# EAGLE design base-board (EAGLE 7.4.0)
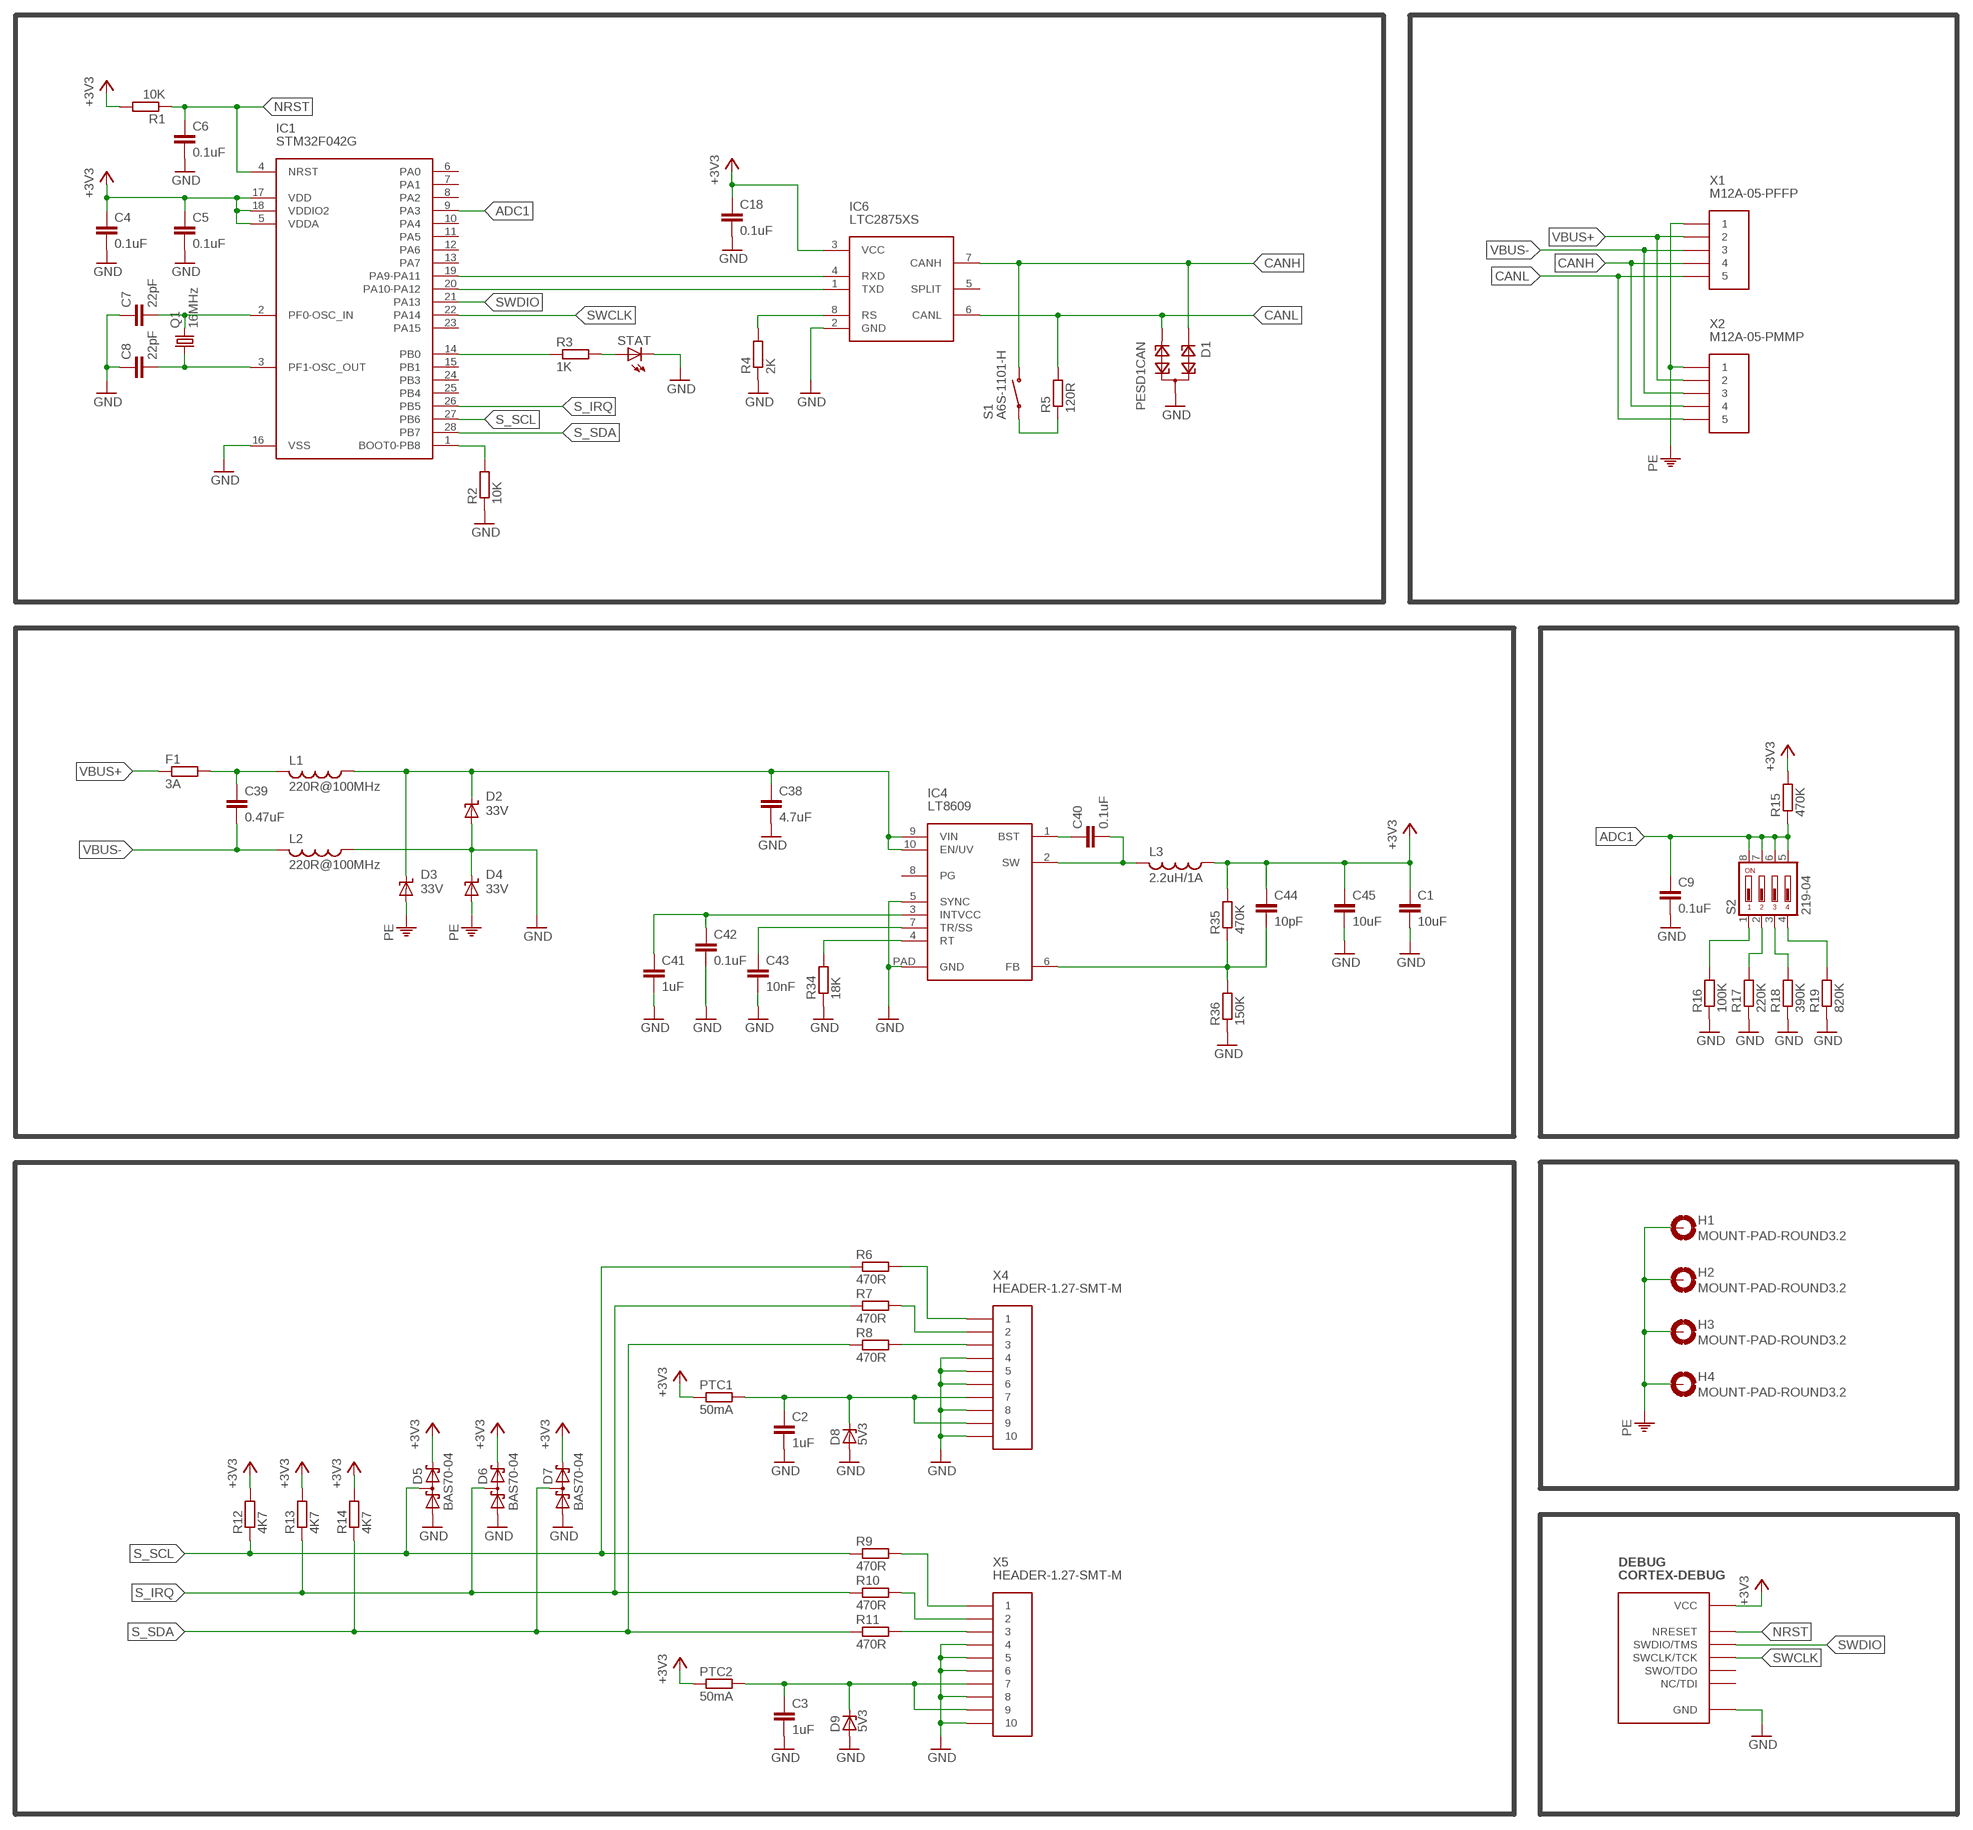
[diagram p0: schematic, sheet 1]

## Parts
C1  10uF  C-EUC1206  [C1206]
C2  1uF  C-EUC0603  [C0603]
C3  1uF  C-EUC0603  [C0603]
C4  0.1uF  C-EUC0603  [C0603]
C5  0.1uF  C-EUC0603  [C0603]
C6  0.1uF  C-EUC0603  [C0603]
C7  22pF  C-EUC0603  [C0603]
C8  22pF  C-EUC0603  [C0603]
C9  0.1uF  C-EUC0603  [C0603]
C18  0.1uF  C-EUC0603  [C0603]
C38  4.7uF  C-EUC1206  [C1206]
C39  0.47uF  C-EUC1206  [C1206]
C40  0.1uF  C-EUC0603  [C0603]
C41  1uF  C-EUC0603  [C0603]
C42  0.1uF  C-EUC0603  [C0603]
C43  10nF  C-EUC0603  [C0603]
C44  10pF  C-EUC0603  [C0603]
C45  10uF  C-EUC1206  [C1206]
D1  PESD1CAN  [SOT23]
D2  33V  SUPPRESSOR-SMBJ  [SMBJ]
D3  33V  SUPPRESSOR-SMBJ  [SMBJ]
D4  33V  SUPPRESSOR-SMBJ  [SMBJ]
D5  BAS70-04  [SOT23]
D6  BAS70-04  [SOT23]
D7  BAS70-04  [SOT23]
D8  5V3  ZENER-DIODESOT23  [SOT23]
D9  5V3  ZENER-DIODESOT23  [SOT23]
DEBUG  CORTEX-DEBUG  [CORTEX-DEBUG]
F1  3A  R-EU_R0805  [R0805]
H1  MOUNT-PAD-ROUND3.2  [3,2-PAD]
H2  MOUNT-PAD-ROUND3.2  [3,2-PAD]
H3  MOUNT-PAD-ROUND3.2  [3,2-PAD]
H4  MOUNT-PAD-ROUND3.2  [3,2-PAD]
IC1  STM32F042G  [UFQFPN28]
IC4  LT8609  [MSOP10-PAD]
IC6  LTC2875XS  [SOIC8]
L1  220R@100MHz  L-USL3216C  [L3216C]
L2  220R@100MHz  L-USL3216C  [L3216C]
L3  2.2uH/1A  L-USL3216C  [L3216C]
PTC1  50mA  R-EU_R1206  [R1206]
PTC2  50mA  R-EU_R1206  [R1206]
Q1  16MHz  XO_3225  [XTAL_3225]
R1  10K  R-EU_R0603  [R0603]
R2  10K  R-EU_R0603  [R0603]
R3  1K  R-EU_R0603  [R0603]
R4  2K  R-EU_R0603  [R0603]
R5  120R  R-EU_R0603  [R0603]
R6  470R  R-EU_R0603  [R0603]
R7  470R  R-EU_R0603  [R0603]
R8  470R  R-EU_R0603  [R0603]
R9  470R  R-EU_R0603  [R0603]
R10  470R  R-EU_R0603  [R0603]
R11  470R  R-EU_R0603  [R0603]
R12  4K7  R-EU_R0603  [R0603]
R13  4K7  R-EU_R0603  [R0603]
R14  4K7  R-EU_R0603  [R0603]
R15  470K  R-EU_R0603  [R0603]
R16  100K  R-EU_R0603  [R0603]
R17  220K  R-EU_R0603  [R0603]
R18  390K  R-EU_R0603  [R0603]
R19  820K  R-EU_R0603  [R0603]
R34  18K  R-EU_R0603  [R0603]
R35  470K  R-EU_R0603  [R0603]
R36  150K  R-EU_R0603  [R0603]
S1  A6S-1101-H  [A6S-1]
S2  219-04  [CTS-219-04]
STAT  LEDCHIPLED_0805  [CHIPLED_0805]
X1  M12A-05-PFFP  [AMP-M12A-05-PFFP]
X2  M12A-05-PMMP  [AMP-M12A-05-PMMP]
X4  HEADER-1.27-SMT-M  [HEADER-1.27-SMT-M]
X5  HEADER-1.27-SMT-M  [HEADER-1.27-SMT-M]

## Nets
+3V3: C1.1 C4.1 C5.1 C18.1 C44.1 C45.1 D5.2(C2) D6.2(C2) D7.2(C2) DEBUG.VCC IC1.5(VDDA) IC1.17(VDD) IC1.18(VDDIO2) IC6.3(VCC) L3.1 PTC1.1 PTC2.1 R1.2 R12.2 R13.2 R14.2 R15.2 R35.2
ADC1: C9.1 IC1.9(PA3) R15.1 S2.5 S2.6 S2.7 S2.8
CANH [can]: D1.1 IC6.7(CANH) S1.1B(B) X1.4 X2.4
CANL [can]: D1.2 IC6.6(CANL) R5.2 X1.5 X2.5
GND: C1.2 C2.2 C3.2 C4.2 C5.2 C6.2 C7.1 C8.1 C9.2 C18.2 C38.2 C41.2 C42.2 C43.2 C45.2 D1.3 D2.A D4.C D5.1(A1) D6.1(A1) D7.1(A1) D8.1(A) D9.1(A) DEBUG.GND1(GND) DEBUG.GND2(GND) DEBUG.GND_DETECT(GND) IC1.16(VSS) IC4.5(SYNC) IC4.PAD(GND) IC6.2(GND) L2.1 R2.1 R4.1 R16.1 R17.1 R18.1 R19.1 R34.1 R36.1 STAT.C X4.4 X4.5 X4.6 X4.8 X4.10 X5.4 X5.5 X5.6 X5.8 X5.10
LED: IC1.14(PB0) R3.1
N$1 [power]: C38.1 D2.C D3.C IC4.9(VIN) IC4.10(EN/UV) L1.1
N$2: R3.2 STAT.A
N$3: IC1.20(PA10-PA12) IC6.1(TXD)
N$4: IC1.19(PA9-PA11) IC6.4(RXD)
N$5: IC6.8(RS) R4.2
N$6: R5.1 S1.1A(A)
N$7: R8.2 X4.3
N$8: C39.1 F1.2 L1.2
N$9: C7.2 IC1.2(PF0-OSC_IN) Q1.3
N$10: C8.2 IC1.3(PF1-OSC_OUT) Q1.1
N$11: IC1.1(BOOT0-PB8) R2.2
N$12: R7.2 X4.2
N$13: C2.1 D8.3(C) PTC1.2 X4.7 X4.9
N$14: C3.1 D9.3(C) PTC2.2 X5.7 X5.9
N$15: R6.2 X4.1
N$16: R11.2 X5.3
N$17: R10.2 X5.2
N$18: R9.2 X5.1
N$20: R16.2 S2.1
N$21: R17.2 S2.2
N$22: R18.2 S2.3
N$23: R19.2 S2.4
N$39: C40.1 IC4.1(BST)
N$40: C40.2 IC4.2(SW) L3.2
N$42: C41.1 C42.1 IC4.3(INTVCC)
N$44: C43.1 IC4.7(TR/SS)
N$45: IC4.4(RT) R34.2
N$46: C44.2 IC4.6(FB) R35.1 R36.2
NRST: C6.1 DEBUG.NRESET IC1.4(NRST) R1.1
PE [pe]: D3.A D4.A H1.B3,2(MOUNT) H2.B3,2(MOUNT) H3.B3,2(MOUNT) H4.B3,2(MOUNT) X1.1 X2.1
S_IRQ: D6.3(C1A2) IC1.26(PB5) R7.1 R10.1 R13.1
S_SCL: D5.3(C1A2) IC1.27(PB6) R6.1 R9.1 R12.1
S_SDA: D7.3(C1A2) IC1.28(PB7) R8.1 R11.1 R14.1
SWCLK: DEBUG.SWCLK/TCK IC1.22(PA14)
SWDIO: DEBUG.SWDIO/TMS IC1.21(PA13)
VBUS+ [power]: F1.1 X1.2 X2.2
VBUS- [power]: C39.2 L2.2 X1.3 X2.3
Unconnected: DEBUG.NC/TDI DEBUG.SWO/TDO IC1.6(PA0) IC1.7(PA1) IC1.8(PA2) IC1.10(PA4) IC1.11(PA5) IC1.12(PA6) IC1.13(PA7) IC1.15(PB1) IC1.23(PA15) IC1.24(PB3) IC1.25(PB4) IC4.8(PG) IC6.5(SPLIT)

## Library data of the parts
C1-C9 C18 C38-C45 = rcl:C-EU: CAPACITOR, European symbol
D1 = diode:PESD1CAN: CAN bus ESD protection diode Source: http://www.nxp.com/documents/data_sheet/PESD1CAN.pdf
D2-D4 = diode:SUPPRESSOR-: Suppressor diode
D5-D7 = diode:BAS70-04: Silicon Schottky Diodes General-purpose diode for high-speed switching
D8 D9 = diode:ZENER-DIODE: Z-Diode
DEBUG = debug-connectors:CORTEX-DEBUG
F1 PTC1 PTC2 R1-R19 R34-R36 = rcl:R-EU_: RESISTOR, European symbol
H1-H4 = holes:MOUNT-PAD-ROUND: MOUNTING PAD, round
IC1 = stm32f042xx:STM32F042G
IC4 = dc-dc-regulators:LT8609
IC6 = can-transceivers:LTC2875
L1-L3 = rcl:L-US: INDUCTOR, American symbol
Q1 = crystals:XO_3225
S1 = omron-a6s:A6S-1101-H
S2 = switch-dil:219-04*: Surface Mount DIP Switch Series 219 SMT CTS Electronic Components Sourc: www.ctscorp.com; OC_FARNELL: unknown; OC_NEWARK: unknown
STAT = led:LED: LED OSRAM: - CHIPLED LG R971, LG N971, LY N971, LG Q971, LY Q971, LO R971, LY R971 LH N974, LH R974 LS Q976, LO Q976, LY Q976 LO Q996 - Hyper CHIPLED LW Q18S LB Q993, LB Q99A, LB R99A - SideLED LS A670, LO A670, LY A670, LG A670, LP A670 LB A673, LV A673, LT A673, LW A673 LH A674 LY A675 LS A676, LA A676, LO A676, LY A676, LW A676 LS A679, LY A679, LG A679 - Hyper Micro SIDELED® LS Y876, LA Y876, LO Y876, LY Y876 LT Y87S - SmartLED LW L88C, LW L88S LB L89C, LB L89S, LG L890 LS L89K, LO L89K, LY L89K LS L896, LA L896, LO L896, LY L896 - TOPLED LS T670, LO T670, LY T670, LG T670, LP T670 LSG T670, LSP T670, LSY T670, LOP T670, LYG T670 LG T671, LOG T671, LSG T671 LB T673, LV T673, LT T673, LW T673 LH T674 LS T676, LA T676, LO T676, LY T676, LB T676, LH T676, LSB T676, LW T676 LB T67C, LV T67C, LT T67C, LS T67K, LO T67K, LY T67K, LW E67C LS E67B, LA E67B, LO E67B, LY E67B, LB E67C, LV E67C, LT E67C LW T67C LS T679, LY T679, LG T679 LS T770, LO T770, LY T770, LG T770, LP T770 LB T773, LV T773, LT T773, LW T773 LH T774 LS E675, LA E675, LY E675, LS T675 LS T776, LA T776, LO T776, LY T776, LB T776 LHGB T686 LT T68C, LB T68C - Hyper Mini TOPLED® LB M676 - Mini TOPLED Santana® LG M470 LS M47K, LO M47K, LY M47K Source: http://www.osram.convergy.de LUXEON: - LUMILED® LXK2-PW12-R00, LXK2-PW12-S00, LXK2-PW14-U00, LXK2-PW14-V00 LXK2-PM12-R00, LXK2-PM12-S00, LXK2-PM14-U00 LXK2-PE12-Q00, LXK2-PE12-R00, LXK2-PE12-S00, LXK2-PE14-T00, LXK2-PE14-U00 LXK2-PB12-K00, LXK2-PB12-L00, LXK2-PB12-M00, LXK2-PB14-N00, LXK2-PB14-P00, LXK2-PB14-Q00 LXK2-PR12-L00, LXK2-PR12-M00, LXK2-PR14-Q00, LXK2-PR14-R00 LXK2-PD12-Q00, LXK2-PD12-R00, LXK2-PD12-S00 LXK2-PH12-R00, LXK2-PH12-S00 LXK2-PL12-P00, LXK2-PL12-Q00, LXK2-PL12-R00 Source: www.luxeon.com KINGBRIGHT: KA-3528ASYC Source: www.kingbright.com
X1 = con-amphenol-m12:M12A-05-PFFP
X2 = con-amphenol-m12:M12A-05-PMMP
X4 X5 = con-headers:HEADER-1.27-SMT-M

## Net classes
0 default: width 0.2 mm, drill 0.3 mm, clearance 0.15 mm
1 can: width 0.4 mm, drill 0.3 mm, clearance 0.4 mm
2 pe: width 0.8 mm, drill 0.6 mm, clearance 0.6 mm
3 power: width 0.8 mm, drill 0.6 mm, clearance 0.6 mm

## Board
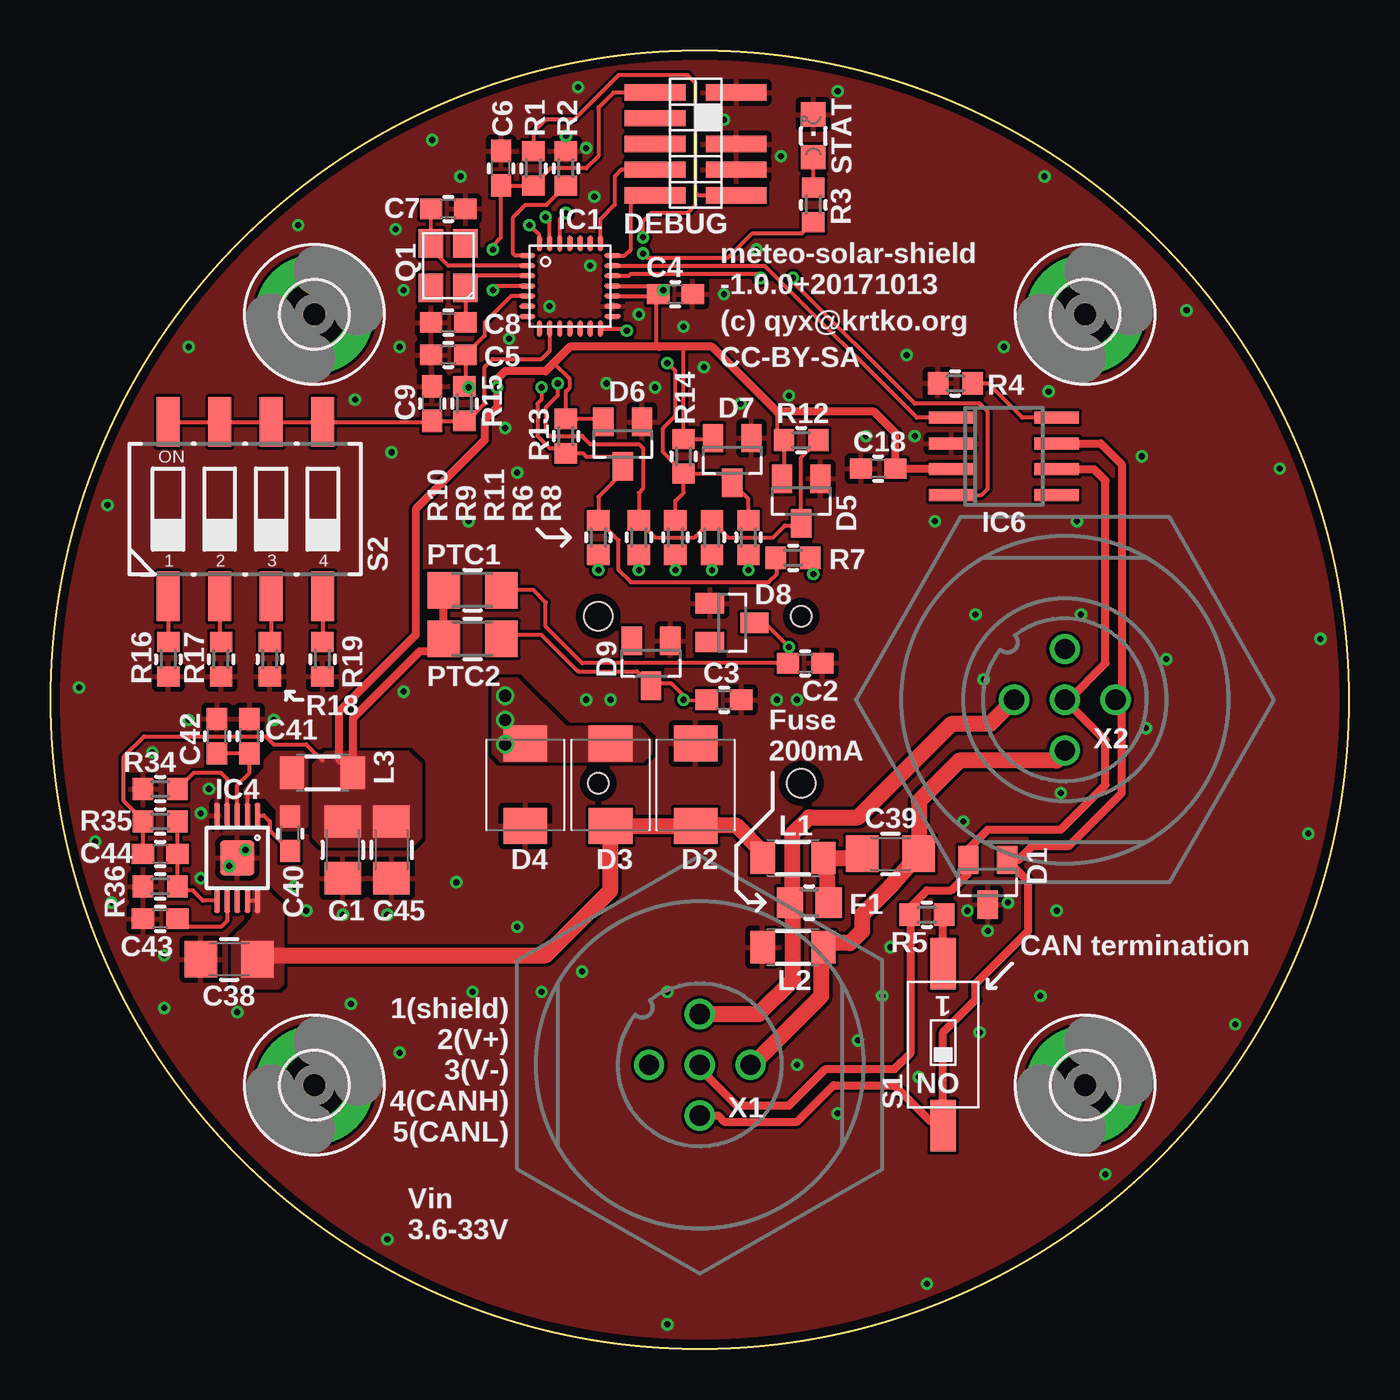
[diagram p1: board, top side]
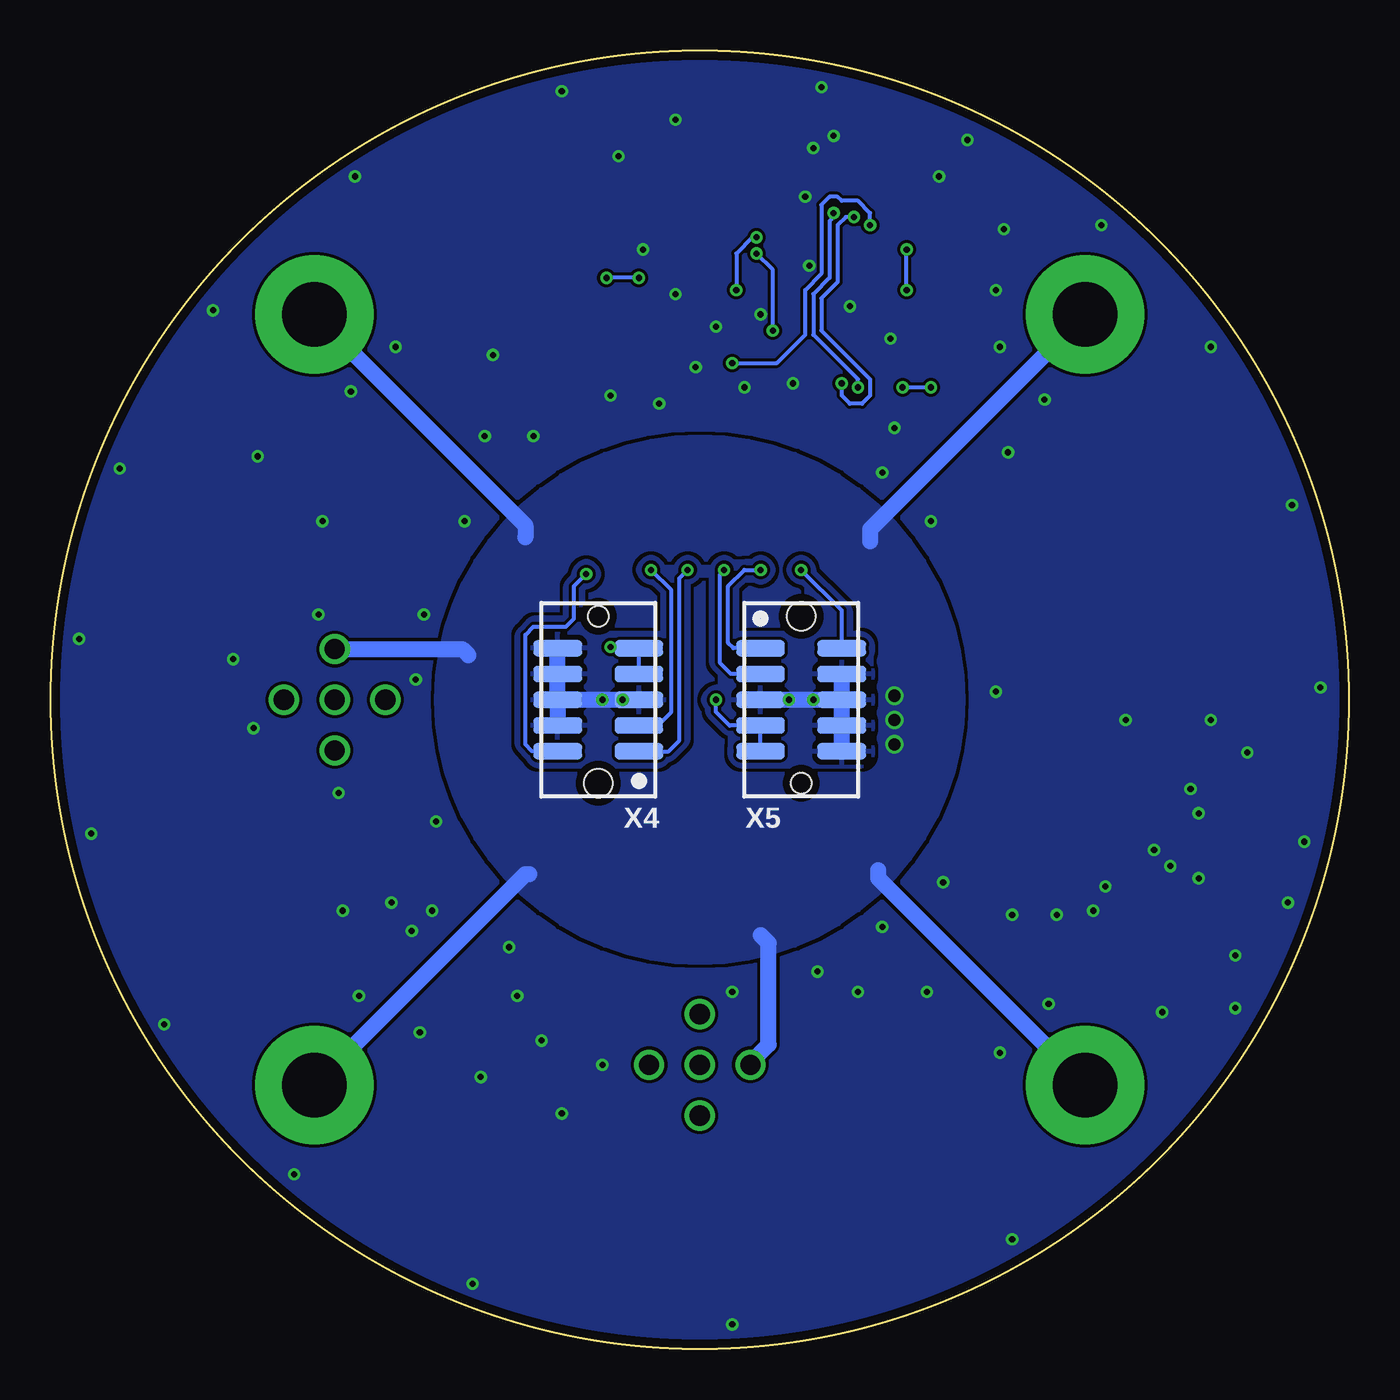
[diagram p2: board, bottom side, seen from below]

Size 64 x 64 mm. Coordinates in mm from the lower left corner, seen from the top.
Outline: circle at 32,32 radius 32
Copper layers (1*16): Top 0.035mm / dielectric 1.5mm / Bottom 0.035mm
Design rules "seeed": minimum track width 0.2mm, minimum drill 0.3mm, track to track 0.15mm, track to pad 0.15mm, pad to pad 0.15mm, via to via 0.15mm, smd to smd 0mil, copper to edge 0.4mm, drill to drill 0.4mm, minimum pad ring 6mil, minimum via ring 6mil, stop-mask expansion 2mil, vias tented up to drill 0.5mm, thermal gap 10mil

### Footprints (pad centres in the part's own frame; a part is rotated, then mirrored left to right if it is on the bottom)
C1206 = smd 1.6 x 1.8: 1 -1.4,0; 2 1.4,0
C0603 = smd 1.1 x 1: 1 -0.85,0; 2 0.85,0
SOT23 = smd 1 x 1.4: 1 -0.95,-1.1; 2 0.95,-1.1; 3 0,1.1
SMBJ = smd 1.78 x 2.16: A 2.04,0; C -2.03,0
CORTEX-DEBUG = smd 0.8 x 3: GND1 -1.27,-2; GND2 0,-2; GND_DETECT 2.54,-2; NC/TDI 1.27,2; NRESET 2.54,2; SWCLK/TCK -1.27,2; SWDIO/TMS -2.54,2; SWO/TDO 0,2; VCC -2.54,-2
R0805 = smd 1.3 x 1.5: 1 -0.95,0; 2 0.95,0
3,2-PAD = drill 3.2 pad 5.842: B3,2 0,0
UFQFPN28 = smd 0.8 x 0.25: 1 -2.1,1.5; 2 -2.1,1; 3 -2.1,0.5; 4 -2.1,0; 5 -2.1,-0.5; 6 -2.1,-1; 7 -2.1,-1.5; 15 2.1,-1.5; 16 2.1,-1; 17 2.1,-0.5; 18 2.1,0; 19 2.1,0.5; 20 2.1,1; 21 2.1,1.5 | smd 0.25 x 0.8: 8 -1.5,-2.1; 9 -1,-2.1; 10 -0.5,-2.1; 11 0,-2.1; 12 0.5,-2.1; 13 1,-2.1; 14 1.5,-2.1; 22 1.5,2.1; 23 1,2.1; 24 0.5,2.1; 25 0,2.1; 26 -0.5,2.1; 27 -1,2.1; 28 -1.5,2.1
MSOP10-PAD = smd 0.3 x 1.2: 1 -1,-2.1; 2 -0.5,-2.1; 3 0,-2.1; 4 0.5,-2.1; 5 1,-2.1; 6 1,2.1; 7 0.5,2.1; 8 0,2.1; 9 -0.5,2.1; 10 -1,2.1 | smd 1.7 x 1.7: PAD 0,0
SOIC8 = smd 0.6 x 2.2: 1 -1.905,-2.6; 2 -0.635,-2.6; 3 0.635,-2.6; 4 1.905,-2.6; 5 1.905,2.6; 6 0.635,2.6; 7 -0.635,2.6; 8 -1.905,2.6
L3216C = smd 1.2 x 1.6: 1 -1.5,0; 2 1.5,0
R1206 = smd 1.6 x 1.803: 1 -1.422,0; 2 1.422,0
XTAL_3225 = smd 1.4 x 1.2: 1 -1.1,-0.85; 2 1.1,-0.85; 3 1.1,0.85; 4 -1.1,0.85
R0603 = smd 1 x 1.1: 1 -0.85,0; 2 0.85,0
A6S-1 = smd 1.27 x 2.54: 1A 0,-4; 1B 0,4
CTS-219-04 = smd 1.13 x 2.44: 1 -3.81,-4.3; 2 -1.27,-4.3; 3 1.27,-4.3; 4 3.81,-4.3; 5 3.81,4.3; 6 1.27,4.3; 7 -1.27,4.3; 8 -3.81,4.3
CHIPLED_0805 = smd 1.2 x 1.2: A 0,-1.05; C 0,1.05
AMP-M12A-05-PFFP = drill 1: 1 -2.5,0; 2 0,2.5; 3 2.5,0; 4 0,-2.5; 5 0,0
AMP-M12A-05-PMMP = drill 1: 1 2.5,0; 2 0,2.5; 3 -2.5,0; 4 0,-2.5; 5 0,0
HEADER-1.27-SMT-M = smd 0.8 x 2.4: 1 -2.54,-2; 2 -2.54,2; 3 -1.27,-2; 4 -1.27,2; 5 0,-2; 6 0,2; 7 1.27,-2; 8 1.27,2; 9 2.54,-2; 10 2.54,2 | hole 1: 4.115,0 | hole 1.4: -4.115,0

### Placement (x,y rotation side)
C1  14.4,24.6 270 top
C2  37.2,33.8 0 top
C3  33.2,32 0 top
C4  30.8,52 0 top
C5  19.6,49 180 top
C6  22.2,58.2 90 top
C7  19.6,56.2 180 top
C8  19.6,50.6 0 top
C9  18.8,46.6 90 top
C18  40.8,43.4 180 top
C38  8.8,19.2 180 top
C39  41.4,24.4 0 top
C40  11.8,25.4 90 top
C41  9.8,30.2 90 top
C42  8.2,30.2 90 top
C43  5.4,21.2 180 top
C44  5.4,24.4 0 top
C45  16.8,24.6 270 top
D1  46.2,23 180 top
D2  31.8,27.8 90 top
D3  27.6,27.8 90 top
D4  23.4,27.8 90 top
D5  37,41.8 180 top
D6  28.2,44.6 180 top
D7  33.6,43.8 180 top
D8  33.6,35.8 270 top
D9  29.6,33.8 180 top
DEBUG  31.8,59.4 90 top
F1  37.4,22 0 top
H1  51,13 0 top
H2  13,13 0 top
H3  51,51 0 top
H4  13,51 0 top
IC1  25.6,52.4 0 top
IC4  9.2,24.2 180 top
IC6  47,44 270 top
L1  36.6,24.2 0 top
L2  36.6,19.8 0 top
L3  13.4,28.4 180 top
PTC1  20.8,37.4 0 top
PTC2  20.8,35 0 top
Q1  19.6,53.4 90 top
R1  23.8,58.2 90 top
R2  25.4,58.2 270 top
R3  37.6,56.4 90 top
R4  44.6,47.6 0 top
R5  43.2,21.4 180 top
R6  32.6,40 270 top
R7  36.6,39 0 top
R8  34.4,40 270 top
R9  29,40 270 top
R10  27,40 270 top
R11  30.8,40 270 top
R12  37,44.8 180 top
R13  25.4,45 90 top
R14  31.2,44 90 top
R15  20.4,46.6 90 top
R16  5.8,34 90 top
R17  8.4,34 90 top
R18  10.8,34 90 top
R19  13.4,34 90 top
R34  5.4,27.6 0 top
R35  5.4,26 180 top
R36  5.4,22.8 0 top
S1  44,15 180 top
S2  9.6,41.4 0 top
STAT  37.6,59.8 0 top
X1  32,14 0 top
X2  50,32 90 top
X4  37,32 90 bottom
X5  27,32 270 bottom

### Tracks (layer width: path | path; a pad name or v marks a point on that pad's centre or on a via)
+3V3  (via drill 0.3)
  Top 0.2: C44.1 R35.2 4.55,26.05 3.6,27 3.6,29.2 4.6,30.2 10.6,30.2 11,29.8 12.6,29.8 13.4,29 | IC1.5 22.7,51.9 21.4,50.6 21.4,49.95 C5.1 20.45,47.5 | 20.45,47.5 R15.2 | IC1.17 29.85,51.9 | 29.85,51.9 C4.1 | IC1.18 29.55,52.4 C4.1 | 31.8,57 31.8,56.4 31.4,56 29.6,56 29.2,55.6 v29.2,54.8 | 31.8,57 31.8,62.4 31.4,62.8 28,62.8 25.8,60.6 24.4,60.6 23.8,60 R1.2 | v30.2,52.2 30.15,52.2 C4.1 | 30,51.95 C4.1 | D6.2 27.6,45.85 R13.2 25.4,47.2 25.6,47.4 25.6,47.8 24.8,48.6 | 29.85,51.9 29.85,49.55 30,49.4 | 20.45,47.5 20.5,47.5 v20.6,47.4 | 31.2,49.4 R14.2 32.6,44.85 D7.2 | D5.2 36.15,43 R12.2 35.8,45.15 35.8,46.2 | DEBUG.VCC 31.94,56.86 31.8,57
  Top 0.4: IC6.3 41.81,43.37 C18.1 41.65,45.15 40.6,46.2 35.8,46.2 32.6,49.4 31.2,49.4 30,49.4 25.6,49.4 24.8,48.6 24.4,48.2 22.4,48.2 22,47.8 v22,47.4 22,46.4 21.4,45.8 21.4,44.8 18,41.4 18,35.2 14.2,31.4 14.2,29.1 L3.1 14.9,31.1 18.2,34.4 18.78,34.4 PTC2.1 PTC1.1
  Bottom 0.2: v20.6,47.4 v22,47.4 | v29.2,54.8 29.4,54.8 30.2,54 v30.2,52.2
  pour Top (no thermals): 13.6,29.4 17.6,29.4 18.2,28.8 18.2,25.2 17.8,24.8 13.4,24.8 13,25.2 13,28.8
ADC1
  Top 0.2: S2.8 S2.7 S2.6 S2.5 18.75,45.7 C9.1 R15.1 20.55,45.75 21.4,46.6 21.4,48.4 21.8,48.8 24.2,48.8 24.6,49.2 IC1.9
CANH
  Top 0.4: X1.4 32.9,11.5 33.2,11.2 36.8,11.2 38.6,13 41.6,13 43.4,11.2 43.8,11.2 S1.1B 44,15.6 45.6,17.2 45.6,18 48.2,20.6 48.2,23.05 D1.1 47.7,24.1 48.4,24.8 50.2,24.8 52.8,27.4 52.8,31.7 X2.4 52.8,32.3 52.8,43.6 51.77,44.63 IC6.7
CANL
  Top 0.4: X1.5 32,13.8 33.8,12 36.4,12 38.2,13.8 41.6,13.8 42.4,14.6 42.4,21.35 R5.2 42.35,21.75 43.2,22.6 44.4,22.6 45.2,23.4 45.2,24.05 D1.2 45.25,24.65 46.2,25.6 49.8,25.6 52,27.8 52,30 X2.5 50.2,32 52,33.8 52,42.8 51.44,43.37 IC6.6
GND  (via drill 0.3)
  Bottom 0.8: X5.10 X5.8 X5.6 | X5.6 X5.4 | X5.6 v27.6,32 X5.5 | X4.5 v35.8,32 X4.6 | X4.6 X4.4 | X4.6 X4.8 X4.10
  other vias: 9.2,16.6 23,20.8 20,23 26.2,18.6 30.4,17.6 41.4,19.8 49.6,21.6 45,26 41,17.4 36.8,14 39.8,15.2 45.8,15.6 48.8,17.4 46,33 45.6,36.2 55,34 49.8,27.4 54,30.6 50.6,40.8 50.8,36.2 43.6,40.8 40.2,45 49.2,47.2 47,49.4 53.8,44 23,43.2 20.6,40.8 15,46.8 17.2,49.4 17.2,14.6 14.8,17 16.6,5.4 30.4,1.2 43.2,3.2 52,8.6 58.4,16 62,25.4 62.6,35 60.6,43.4 56,51.2 49,57.8 38.8,62 26,62.2 18.8,59.6 12.2,55.4 6.8,49.4 2.8,41.6 1.4,32.6 2.2,25 5.6,16.8 17.4,32.4 34,46.6 38.8,11.6 24.2,17.6 20.8,17.6 5.6,19.4 3,22 5,29.4 6.8,31 11,31 16.6,21.4 14.4,21.4 12.6,21.6 12,22.8 8.8,23.8 9.6,24.6 7.8,27.6 7.4,26.4 7.4,23.2 45.2,21.6 46.2,20.6 47.2,22 26.4,32 36.8,32 22.6,49.8 24.6,51.4 26.6,53.4 20.2,57.8 17,55.2 17.4,52.2 16.8,44.2 22.4,45.4 29,51 33.2,52 33.2,60.6 36,58.8 26.4,59.2 25.4,59.8 26.8,56.8 29.8,47.4 42.6,45 36.4,47 31.2,50.4 27.4,47.6 42.2,49 34.8,54.2 32.2,48.4 42.8,13.4
  pour Bottom (rank 2): 32,0 arc-90 0,32 arc-90 32,64 arc-90 64,32 arc-90
  pour Top (rank 2): 32,0 arc-90 0,32 arc-90 32,64 arc-90 64,32 arc-90
LED  (via drill 0.3)
  Top 0.2: IC1.14 28.3,50.3 v28.4,50.2 | v29.2,54 29.4,53.8 33.4,53.8 34.6,55 37.05,55 R3.1
  Bottom 0.2: v28.4,50.2 28.4,53.2 v29.2,54
N$1
  Top 0.2: IC4.9 IC4.10
  Top 0.8: C38.1 10.2,19.4 24.4,19.4 27.6,22.6 D3.C D2.C 31.83,25.8 33.8,25.8 35.1,24.5 L1.1
  pour Top (no thermals): 9.8,22.6 10.6,22.6 11.4,21.8 11.4,18 11.2,17.8 9.2,17.8 9,18 9,20.2 9.8,21
N$2
  Top 0.2: R3.2 STAT.A
N$3
  Top 0.2: IC1.20 35.2,53.4 42.7,45.91 IC6.1
N$4  (via drill 0.3)
  Top 0.2: IC1.19 28.5,52.9 28.6,53 34.8,53 v35,52.8 | IC6.4 45.9,42.09 46.2,42.4 46.2,46.2 45.8,46.6 42.6,46.6 36.6,52.6 v36.6,52.8
  Bottom 0.2: v35,52.8 v36.6,52.8
N$5
  Top 0.2: R4.2 46.2,47.6 47.9,45.91 IC6.8
N$6
  Top 0.4: S1.1A 44,21.35 R5.1
N$7  (via drill 0.3)
  Top 0.2: v34.4,38.4 R8.2
  Bottom 0.2: X4.3 34.07,30.73 33.4,31.4 33.4,37.4 v34.4,38.4
N$8
  Top 0.8: F1.2 38.25,24.05 L1.2 39.6,24.2 C39.1
N$9
  Top 0.2: IC1.2 19.6,53.4 19,54 19,54.25 Q1.3 C7.2
N$10
  Top 0.2: IC1.3 21.05,52.9 Q1.1 C8.2
N$11
  Top 0.2: IC1.1 22.9,53.9 22.8,54 22.8,55.8 23.4,56.4 24.45,56.4 R2.2
N$12  (via drill 0.3)
  Top 0.2: v37.6,38.2 37.6,38.85 R7.2
  Bottom 0.2: X4.2 40.26,29.46 40.6,29.8 40.6,35.2 40.2,35.6 38.6,35.6 38.2,36 38.2,37.6 v37.6,38.2
N$13  (via drill 0.3)
  Top 0.2: D8.3 35.2,35.8 v36.4,34.6 36.4,33.85 C2.1 26.2,33.8 24.4,35.6 24.4,36.8 23.8,37.4 PTC1.2
  Bottom 0.2: X4.7 X4.9 36.34,34.54 v36.4,34.6
N$14  (via drill 0.3)
  Top 0.2: C3.1 32.4,31.95 v31.2,32 31.2,32.2 30.6,32.8 29.7,32.8 D9.3 28.9,33.4 26,33.4 24.2,35.2 22.42,35.2 PTC2.2
  Bottom 0.2: X5.9 X5.7 30.53,30.73 31.2,31.4 v31.2,32
N$15  (via drill 0.3)
  Top 0.2: v32.6,38.4 R6.2
  Bottom 0.2: X4.1 33.54,29.46 33,30 33,38 v32.6,38.4
N$16  (via drill 0.3)
  Top 0.2: v30.8,38.4 R11.2
  Bottom 0.2: X5.3 30.47,33.27 31,33.8 31,38.2 v30.8,38.4
N$17  (via drill 0.3)
  Top 0.2: v27,38.4 R10.2
  Bottom 0.2: X5.2 25,36.4 v27,38.4
N$18  (via drill 0.3)
  Top 0.2: v29,38.4 R9.2
  Bottom 0.2: X5.1 30.34,34.54 30.6,34.8 30.6,37.6 29.8,38.4 v29,38.4
N$20
  Top 0.2: S2.1 R16.2
N$21
  Top 0.2: S2.2 8.33,34.92 R17.2
N$22
  Top 0.2: S2.3 10.87,34.92 R18.2
N$23
  Top 0.2: S2.4 R19.2
N$39
  Top 0.2: IC4.1 10.5,26.3 10.8,26 10.8,25.55 C40.1
N$40
  Top 0.2: IC4.2 9.7,27.3 9.8,27.4
  pour Top (no thermals): 11,29.4 12.4,29.4 12.6,29.2 12.6,25.8 12.4,25.6 11.4,25.6 11.2,25.8 11.2,26.6 10.6,27.2 9.6,27.2 9.6,27.6 10.2,28.2 10.6,28.6 10.6,29
N$42
  Top 0.2: IC4.3 9.2,27.8 9.8,28.4 C41.1 C42.1
N$44
  Top 0.2: IC4.7 8.7,21.1 8.4,20.8 6.65,20.8 C43.1
N$45
  Top 0.2: IC4.4 8.7,28.1 8.4,28.4 7.05,28.4 R34.2
N$46
  Top 0.2: IC4.6 7.5,22.1 7,22.6 6.45,22.6 R36.2 C44.2 R35.1
NRST  (via drill 0.3)
  Top 0.2: IC1.4 22,52.4 v21.8,52.2 | v21.8,54.2 21.8,54.4 22.2,54.8 C6.1 R1.1 24.65,58.2 26.4,58.2 27,58.8 27,61.2 27.74,61.94 DEBUG.NRESET
  Bottom 0.2: v21.8,52.2 v21.8,54.2
PE  (via drill 0.6)
  Bottom 0.8: H4.B3,2 23.6,40.4 23.6,39.8 | H3.B3,2 40.6,40.6 40.6,40 | H1.B3,2 40.6,23.4 40.4,23.4 | H2.B3,2 23.2,23.2 23.2,23.6 | X2.1 43.7,34.5 43.4,34.2 | X1.1 29.5,14.1 28.6,15 28.6,20 29,20.4
  other vias: 22.4,31 22.4,32.2 22.4,29.8
  pour Bottom: 32,45 arc90 19,32 arc90 32,19 arc90 45,32 arc90
  pour Top (no thermals): 22.2,29 29.2,29 29.6,29.4 29.6,30 29,30.6 25.4,30.6 23,33 22.2,33 21.8,32.6 21.8,29.4
S_IRQ  (via drill 0.3)
  Top 0.2: IC1.26 25.1,55.7 v25.4,56 | v24.2,47.4 24.2,46.8 24,46.6 24,45 24.6,44.4 25.15,44.4 R13.1 26.25,44.15 26.4,44 27.7,44 D6.3 28.2,43.2 27,42 R10.1 28,39.85 28,38.4 28.6,37.8 35.4,37.8 35.8,38.2 35.8,38.95 R7.1
  Bottom 0.2: v25.4,56 25.4,55.8 25.6,55.6 25.6,52.8 26.4,52 26.4,50 24.2,47.8 v24.2,47.4
S_SCL  (via drill 0.3)
  Top 0.2: IC1.27 24.6,55.6 v24.4,55.8 | R12.1 37,43.95 D5.3 36.9,40.6 36.2,40.6 35.6,40 33.4,40 32.6,40.8 R6.1 31.75,40 29.8,40 29,40.8 R9.1 29,42.2 29.2,42.4 29.2,44.4 29,44.6 26.6,44.6 26.2,45 24.6,45 24.4,45.2 24.4,46.4 25,47 v25,47.6
  Bottom 0.2: v24.4,55.8 24.8,55.8 25.2,55.4 25.2,52.6 26,51.8 26,50.2 23.6,47.8 23.6,47 24,46.6 24.6,46.6 25,47 v25,47.6
S_SDA  (via drill 0.3)
  Top 0.2: IC1.28 24.1,54.9 v23.6,55.4 | R14.1 31.2,43.2 30.2,44.2 30.2,45.4 30.8,46 30.8,48.2 v30.4,48.6 | R8.1 34.4,41.9 D7.3 33.15,43.15 R14.1 | R11.1 30.8,41.8 31.2,42.2 R14.1
  Bottom 0.2: v23.6,55.4 23.6,56 24.2,56.6 25,56.6 25.2,56.8 25.6,56.8 26,56.4 26,53 26.8,52.2 26.8,50 28.2,48.6 v30.4,48.6
SWCLK
  Top 0.2: DEBUG.SWCLK/TCK 28.13,58.13 27.8,57.8 27.8,56.4 27.1,55.7 IC1.22
SWDIO
  Top 0.2: DEBUG.SWDIO/TMS 29,56.86 | 29,56.86 28.86,56.86 | IC1.21 28.3,53.9 28.6,54.2 28.6,56.46 29,56.86
VBUS+
  Top 0.8: X1.2 34.9,16.5 36.6,18.2 36.6,22.35 F1.1 36.55,22.1 36.55,25.35 37.4,26.2 39.8,26.2 44.4,30.8 46.3,30.8 X2.2
VBUS-
  Top 0.8: X1.3 34.6,14.1 34.7,14.1 38,17.4 38,19.7 L2.2 38.3,20 39.4,20 40,20.6 40,21.4 41.4,22.8 C39.2 42.8,27 44.8,29 49.6,29 50,29.4 X2.3

### Text on the board
tPlace: meteo-solar-shield / -1.0.0+20171013 | (c) qyx@krtko.org | CC-BY-SA | Fuse / 200mA | CAN termination | 1(shield) / 2(V+) / 3(V-) / 4(CANH) / 5(CANL) | Vin / 3.6-33V